# EasyEDA Pro project Advanced-filament-RunOut-Sensor.epro

# Schematic Filament runoff sensor
Board Name: Board1; Create Date: 2026-03-11; Page Name: P1; Project Name: Filament run out; Schematic Name: Filament runoff sensor; Update Date: 2026-03-12; Company: EasyEDA.com; Drawn: Paglu; Page Size: A4; Version: V1.0
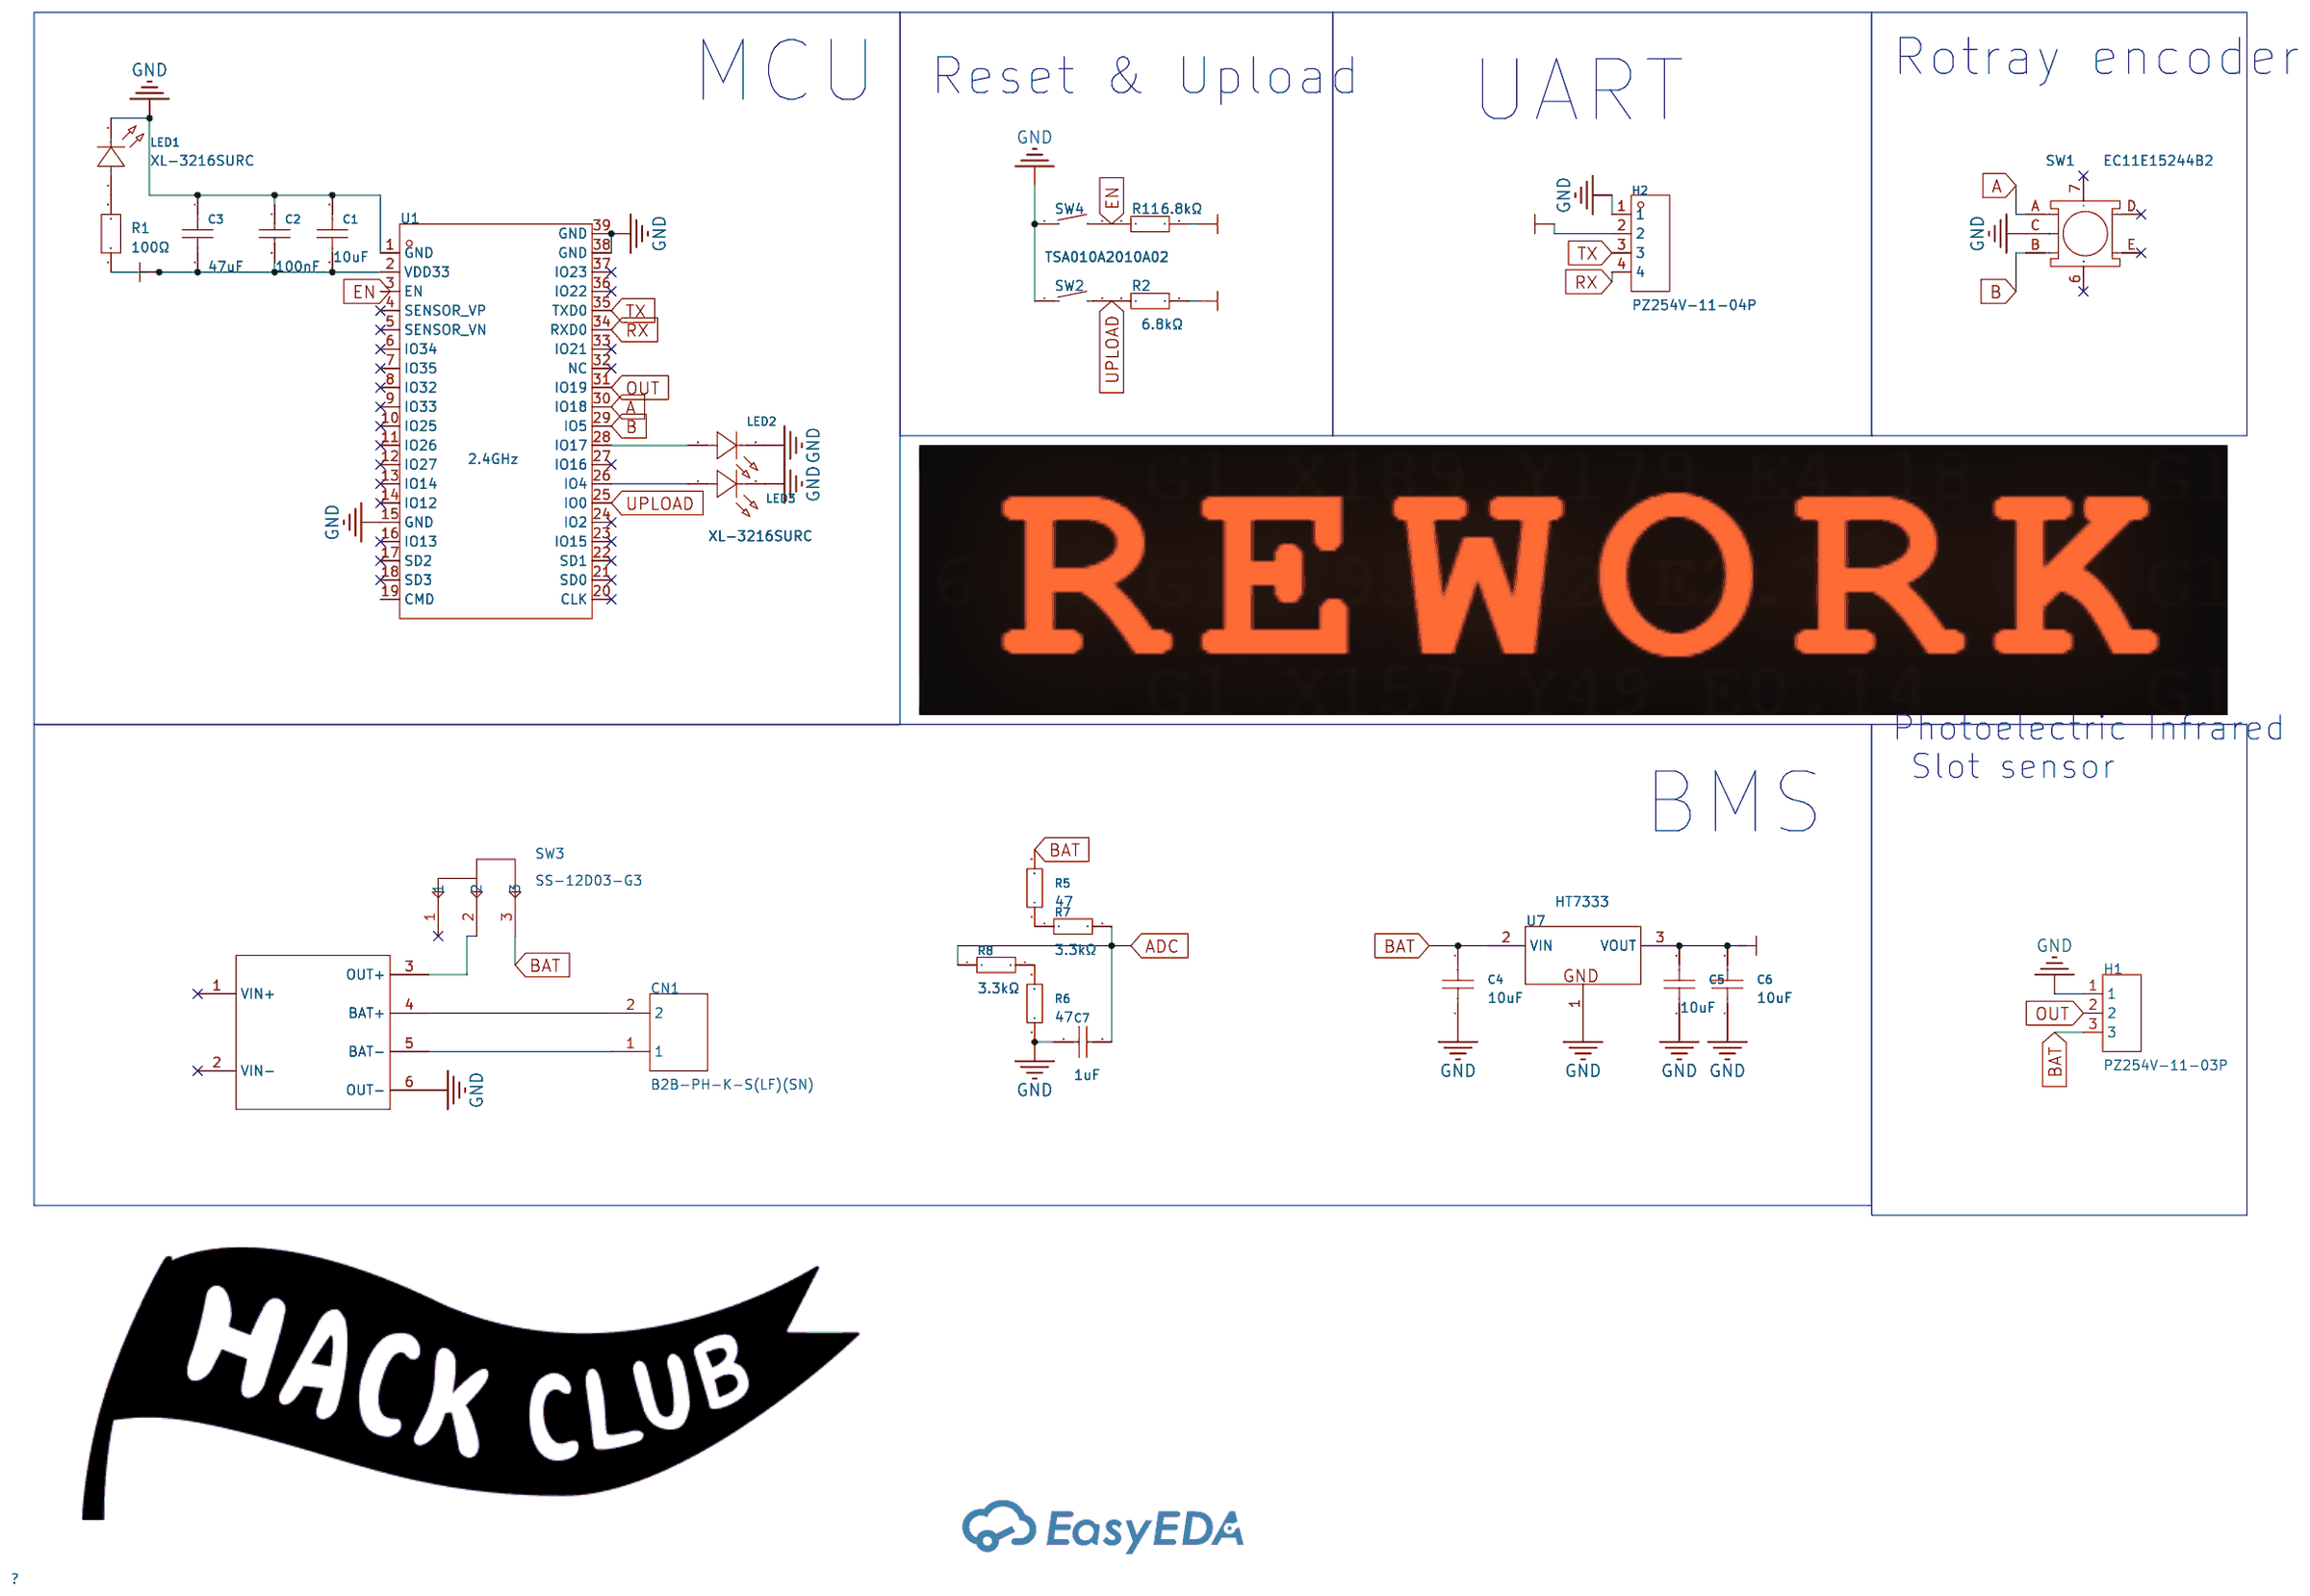
[diagram p0: schematic sheet]

## Parts
C1  10uF  [C1206]
C2  100nF  [C1206]
C3  47uF  [C1206]
C4  10uF  [C0603]
C5  10uF  [C0603]
C6  10uF  [C0603]
C7  1uF  [C0805]
CN1  B2B-PH-K-S(LF)(SN)  [CONN-TH_B2B-PH-K-S]
H1  PZ254V-11-03P  [HDR-TH_3P-P2.54-V-M_PZ254V-11-03P]
H2  PZ254V-11-04P  [HDR-TH_4P-P2.54-V-M]
LED1  XL-3216SURC  [LED1206-R-RD_RED]
LED2  XL-3216SURC  [LED1206-R-RD_RED]
LED3  XL-3216SURC  [LED1206-R-RD_RED]
R1  100Ω  [R1206]
R2  6.8kΩ  [R0603]
R5  47  [R1206]
R6  47  [R1206]
R7  3.3kΩ  [R0603]
R8  3.3kΩ  [R0603]
R11  6.8kΩ  [R0603]
SW1  EC11E15244B2  [SW-TH_EC11XXXXXXXX]
SW2  TSA010A2010A02  [KEY-SMD_L3.9-W3.0-LS5.0]
SW3  SS-12D03-G3  [SW-TH_3P-L8.5-W3.5-P2.50_SS-12D03-G3_C5160828]
SW4  TSA010A2010A02  [KEY-SMD_L3.9-W3.0-LS5.0]
U1  2.4GHz  [WIFIM-SMD_39P-L25.5-W18.0-P1.27-BL]
U6  -  [TP4056 Carging Module]
U7  HT7333  [SOT-89-3_L4.5-W2.5-P1.50-LS4.1-BR]

## Library data of the parts
C1 C3 = 1206B106K160CT: Capacitance:10uF Tolerance:±10% Tolerance:±10% Voltage Rating:16V Temperature Coefficient:X7R; LCSC Part Name: 10uF ±10% 16V; Supplier Part: C105197; Manufacturer: Walsin(华新科); Supplier Footprint: 1206; JLCPCB Part Class: Extended Part; Datasheet: https://item.szlcsc.com/datasheet/1206B106K160CT/106412.html; Supplier: LCSC; Tolerance: ±10%; Voltage Rating: 16V; Temperature Coefficient: X7R
C2 = CL31B104KBCNNNC: Capacitance:100nF Tolerance:±10% Tolerance:±10% Voltage Rating:50V Temperature Coefficient:X7R; LCSC Part Name: 100nF ±10% 50V; Supplier Part: C24497; Manufacturer: SAMSUNG(三星); Supplier Footprint: 1206; JLCPCB Part Class: Basic Part; Datasheet: https://item.szlcsc.com/datasheet/CL31B104KBCNNNC/25237.html; Supplier: LCSC; Tolerance: ±10%; Voltage Rating: 50V; Temperature Coefficient: X7R
C4-C6 = CL10A106MA8NRNC: Capacitance:10uF Tolerance:±20% Tolerance:±20% Voltage Rating:25V Temperature Coefficient:X5R; LCSC Part Name: 10uF ±20% 25V; Supplier Part: C96446; Manufacturer: SAMSUNG(三星); Supplier Footprint: 0603; JLCPCB Part Class: Basic Part; Datasheet: https://item.szlcsc.com/datasheet/CL10A106MA8NRNC/97651.html; Supplier: LCSC; Tolerance: ±20%; Voltage Rating: 25V; Temperature Coefficient: X5R
C7 = CL21B105KBFNNNE: Capacitance:1uF Tolerance:±10% Tolerance:±10% Voltage Rating:50V Temperature Coefficient:X7R; LCSC Part Name: 1uF ±10% 50V; Supplier Part: C28323; Manufacturer: SAMSUNG(三星); Supplier Footprint: 0805; JLCPCB Part Class: Basic Part; Datasheet: https://item.szlcsc.com/datasheet/CL21B105KBFNNNE/29074.html; Supplier: LCSC; Tolerance: ±10%; Voltage Rating: 50V; Temperature Coefficient: X7R
CN1 = B2B-PH-K-S(LF)(SN): Pins Structure:1x2P Pitch:2mm Mounting Type:Through Hole Reference Series:PH Number of Pins:2P Number of Rows:1 Number of PINs Per Row:2 Row Spacing:- Current Rating:2A Contact Material:Brass Contact Plating:Tin Operating Temperature:-25℃~+85℃ Operating T; LCSC Part Name: 1x2P 间距:2mm 直插 系列:PH; Supplier Part: C131337; Manufacturer: JST; Supplier Footprint: 插件,P=2mm; JLCPCB Part Class: Extended Part; Datasheet: https://item.szlcsc.com/datasheet/B2B-PH-K-S(LF)(SN)/142630.html; Supplier: LCSC; Pins Structure: 1x2P; Pitch: 2mm; Mounting Type: Through Hole; Reference Series: PH; Number of Pins: 2P; Number of Rows: 1; Number of PINs Per Row: 2; Current Rating: 2A; Contact Material: Brass; Contact Plating: Tin; Operating Temperature: -25℃~+85℃; Voltage Rating: 100V; Plastic Material: PA66; Flame Retardant Rating: UL94V-0; Supplementary Features: K Pin; Color: White; Z-Height of the Board: 6mm; X-Length of Bottom Edge on Board (Spacing Line): 5.9mm; Y-Width of Bottom Edge on Board: 4.5mm
H1 = PZ254V-11-03P: Pin Structure:1x3P Pitch:2.54mm Row Spacing:- Circluar Pins/Square Pins:Pin Header Mounting Type:Through Hole Number of Rows:1 Number of Pins:3P Current Rating:3A Voltage Rating (Max):250V Length of Mating Pin:6mm Insulation Height:2.5mm Length of End Con; LCSC Part Name: 1x3P 间距:2.54mm 方针 直插; Supplier Part: C2937625; Manufacturer: XFCN(兴飞); Supplier Footprint: 插件,P=2.54mm; JLCPCB Part Class: Extended Part; Datasheet: https://item.szlcsc.com/datasheet/PZ254V-11-03P/3293280.html; Supplier: LCSC; Pin Structure: 1x3P; Pitch: 2.54mm; Circluar Pins/Square Pins: Pin Header; Mounting Type: Through Hole; Number of Rows: 1; Number of Pins: 3P; Current Rating: 3A; Voltage Rating (Max): 250V; Length of Mating Pin: 6mm; Insulation Height: 2.5mm; Length of End Connection Pin: 3mm; Operating Temperature: -40℃~+105℃; Color: Black
H2 = PZ254V-11-04P: Pin Structure:1x4P Pitch:2.54mm Row Spacing:- Circluar Pins/Square Pins:Pin Header Mounting Type:Through Hole Number of Rows:1 Number of Pins:4P Current Rating:3A Voltage Rating (Max):250V Length of Mating Pin:6mm Insulation Height:2.5mm Length of End Con; LCSC Part Name: 1x4P 间距:2.54mm 方针 直插; Supplier Part: C2691448; Manufacturer: XFCN(兴飞); Supplier Footprint: 插件,P=2.54mm; JLCPCB Part Class: Extended Part; Datasheet: https://item.szlcsc.com/datasheet/PZ254V-11-04P/2801085.html; Supplier: LCSC; Pin Structure: 1x4P; Pitch: 2.54mm; Circluar Pins/Square Pins: Pin Header; Mounting Type: Through Hole; Number of Rows: 1; Number of Pins: 4P; Current Rating: 3A; Voltage Rating (Max): 250V; Length of Mating Pin: 6mm; Insulation Height: 2.5mm; Length of End Connection Pin: 3mm; Operating Temperature: -40℃~+105℃; Color: Black
LED1-LED3 = XL-3216SURC: Lamp Holder Type:- Illumination Color:Red Voltage - Forward(Vf):2.4V Voltage - Forward(Vf):2.4V Power(Watts):50mW Forward Current:20mA Wavelength - Dominant:615nm~630nm Wavelength - Dominant:615nm~630nm Peak Wavelength:620nm Diode Configuration:- Lens Col; LCSC Part Name: 1206红贴片式发光二极管; Supplier Part: C965822; Manufacturer: XINGLIGHT(成兴光); Supplier Footprint: 1206; JLCPCB Part Class: Extended Part; Datasheet: https://item.szlcsc.com/datasheet/XL-3216SURC/1051431.html; Supplier: LCSC; Illumination Color: Red; Voltage - Forward(Vf): 2.4V; Power(Watts): 50mW; Forward Current: 20mA; Wavelength - Dominant: 615nm~630nm; Peak Wavelength: 620nm; Lens Color: Water Clear; Luminous Intensity: 225mcd; Viewing Angle: 120°; Mounting Style: op View Mount; Operating Temperature: -40℃~+85℃
R1 = FRC1206F1000TS: Type:Thick Film Resistor Resistance:100Ω Tolerance:±1% Tolerance:±1% Power(Watts):250mW Voltage-Supply(Max):200V Temperature Coefficient:±100ppm/℃ Temperature Coefficient:±100ppm/℃ Operating Temperature:-55℃~+155℃ Operating Temperature:-55℃~+155℃; LCSC Part Name: 100Ω ±1% 250mW 厚膜电阻; Supplier Part: C2907369; Manufacturer: FOJAN(富捷); Supplier Footprint: 1206; JLCPCB Part Class: Extended Part; Supplier: LCSC; Type: Thick Film Resistor; Tolerance: ±1%; Power(Watts): 250mW; Voltage-Supply(Max): 200V; Temperature Coefficient: ±100ppm/℃; Operating Temperature: -55℃~+155℃
R2 R11 = RC0603FR-071KL: Type:Thick Film Resistor Resistance:1kΩ Tolerance:±1% Tolerance:±1% Power(Watts):100mW Voltage-Supply(Max):75V Temperature Coefficient:±100ppm/℃ Temperature Coefficient:±100ppm/℃ Operating Temperature:-55℃~+155℃ Operating Temperature:-55℃~+155℃; LCSC Part Name: 厚膜电阻 1kΩ ±1% 100mW; Supplier Part: C22548; Manufacturer: YAGEO(国巨); Supplier Footprint: 0603; JLCPCB Part Class: Extended Part; Datasheet: https://item.szlcsc.com/datasheet/RC0603FR-071KL/23274.html; Supplier: LCSC; Type: Thick Film Resistor; Tolerance: ±1%; Power(Watts): 100mW; Voltage-Supply(Max): 75V; Temperature Coefficient: ±100ppm/℃; Operating Temperature: -55℃~+155℃
R5 R6 = 1206W4F100KT5E: Type:Thick Film Resistor Resistance:1Ω Tolerance:±1% Tolerance:±1% Power(Watts):250mW Voltage-Supply(Max):200V Temperature Coefficient:±200ppm/℃ Temperature Coefficient:±200ppm/℃ Operating Temperature:-55℃~+155℃ Operating Temperature:-55℃~+155℃; LCSC Part Name: 1Ω ±1% 250mW 厚膜电阻; Supplier Part: C17928; Manufacturer: UNI-ROYAL(厚声); Supplier Footprint: 1206; JLCPCB Part Class: Basic Part; Datasheet: https://item.szlcsc.com/datasheet/1206W4F100KT5E/18616.html; Supplier: LCSC; Type: Thick Film Resistor; Tolerance: ±1%; Power(Watts): 250mW; Voltage-Supply(Max): 200V; Temperature Coefficient: ±200ppm/℃; Operating Temperature: -55℃~+155℃
R7 R8 = 0603WAF3301T5E: Type:Thick Film Resistor Resistance:3.3kΩ Tolerance:±1% Tolerance:±1% Power(Watts):100mW Voltage-Supply(Max):75V Temperature Coefficient:±100ppm/℃ Temperature Coefficient:±100ppm/℃ Operating Temperature:-55℃~+155℃ Operating Temperature:-55℃~+155℃; LCSC Part Name: 3.3kΩ ±1% 100mW 厚膜电阻; Supplier Part: C22978; Manufacturer: UNI-ROYAL(厚声); Supplier Footprint: 0603; JLCPCB Part Class: Basic Part; Datasheet: https://item.szlcsc.com/datasheet/0603WAF3301T5E/23705.html; Supplier: LCSC; Type: Thick Film Resistor; Tolerance: ±1%; Power(Watts): 100mW; Voltage-Supply(Max): 75V; Temperature Coefficient: ±100ppm/℃; Operating Temperature: -55℃~+155℃
SW1 = EC11E15244B2_C470754: Supplier Part: C470754; Manufacturer: ALPSALPINE(阿尔卑斯阿尔派); Supplier Footprint: 插件; JLCPCB Part Class: Extended Part; Datasheet: https://atta.szlcsc.com/upload/public/pdf/source/20191216/C470795_DE763ECE59BD49533DB26DB53E5D34B2.pdf; Supplier: LCSC
SW2 SW4 = TSA010A2010A02: Actuator Style:Round Button Operating Force:1N Mounting Type:Surface Mount,Vertical Length:3.9mm Width:3mm Switch Height:2mm Contact Current:50mA Voltage Rating:12V Life:-; LCSC Part Name: 3*4*2.0H-J 100gf 单弹平脚; Supplier Part: C2888943; Manufacturer: BZCN(博众电气); Supplier Footprint: SMD,3.9x3mm; JLCPCB Part Class: Extended Part; Datasheet: https://item.szlcsc.com/datasheet/TSA010A2010A02/3109346.html; Supplier: LCSC; Actuator Style: Round Button; Operating Force: 1N; Mounting Type: Surface Mount,Vertical; Length: 3.9mm; Width: 3mm; Switch Height: 2mm; Contact Current: 50mA; Voltage Rating: 12V
SW3 = SS-12D03-G3_C5160828: Supplier Part: C5160828; Manufacturer: DEALON(德艺隆); Supplier Footprint: 插件; JLCPCB Part Class: Extended Part; Datasheet: https://atta.szlcsc.com/upload/public/pdf/source/20220914/46967EFD64D75927271155BD7ED48D9B.pdf; Supplier: LCSC
U1 = ESP32-WROOM-32D-N4: Utilized IC / Part:ESP32-DOWD Wireless Standard:Bluetooth4.2 Interface Type:I2C；GPIO；SPI；UART Frequency:2.4GHz Antenna Type:On-board PCB Antenna Output Power:20.5dBm Output Power:20.5dBm Voltage - Supply:2.7V~3.6V Voltage - Supply:2.7V~3.6V Sensitivity:-9; LCSC Part Name: 不带固件 通用型Wi-Fi+BT+BLE MCU模组; Supplier Part: C473012; Manufacturer: ESPRESSIF(乐鑫); Supplier Footprint: SMD,25.5x18mm; JLCPCB Part Class: Extended Part; Datasheet: https://item.szlcsc.com/datasheet/ESP32-WROOM-32D-N4/479662.html; Supplier: LCSC; Utilized IC / Part: ESP32-DOWD; Wireless Standard: Bluetooth4.2; Interface Type: I2C；GPIO；SPI；UART; Antenna Type: On-board PCB Antenna; Output Power: 20.5dBm; Voltage - Supply: 2.7V~3.6V; Sensitivity: -98dBm; Operating Temperature: -40℃~+85℃
U6 = TP4056 Charging Module
U7 = HT7333: Output Type:-; Supplier Part: C259241; Supplier Footprint: SOT-89-3; JLCPCB Part Class: Extended Part; Supplier: LCSC

## Nets
+3V3: C1.2 C2.2 C3.2 C5.2 C6.2 H2.2 R1.1 R2.2 R11.2 U1.2(VDD33) U7.3(VOUT)
GND: C1.1 C2.1 C3.1 C4.1 C5.1 C6.1 C7.1 H1.1 H2.1 LED1.2(A) LED2.2(A) LED3.2(A) R6.1 SW1.C SW2.1 SW4.1 U1.1(GND) U1.15(GND) U1.38(GND) U1.39(GND) U6.6(OUT-) U7.1(GND)
A: SW1.A U1.30(IO18)
ADC: C7.2 R7.2 R8.1
B: SW1.B U1.29(IO5)
BAT: C4.2 H1.3 R5.2 SW3.3 U7.2(VIN)
EN: R11.1 SW4.2 U1.3(EN)
OUT: H1.2 U1.31(IO19)
RX: H2.4 U1.34(RXD0)
TX: H2.3 U1.35(TXD0)
UPLOAD: R2.1 SW2.2 U1.25(IO0)
$1N1540: LED1.1(K) R1.2
$1N1754: SW3.2 U6.3(OUT+)
$1N1756: CN1.2 U6.4(BAT+)
$1N1757: CN1.1 U6.5(BAT-)
$1N2179: R5.1 R7.1
$1N2180: R6.2 R8.2
$1N2787: LED2.1(K) U1.28(IO17)
$1N2791: LED3.1(K) U1.26(IO4)

Not connected (* = marked no-connect by the designer): SW1 6* 7* D* E*; SW3 1*; U1 4(SENSOR_VP)* 5(SENSOR_VN)* 6(IO34)* 7(IO35)* 8(IO32)* 9(IO33)* 10(IO25)* 11(IO26)* 12(IO27)* 13(IO14)* 14(IO12)* 16(IO13)* 17(SD2)* 18(SD3)* 19(CMD) 20(CLK)* 21(SD0)* 22(SD1)* 23(IO15)* 24(IO2)* 27(IO16)* 32(NC)* 33(IO21)* 36(IO22)* 37(IO23)*; U6 1(VIN+)* 2(VIN-)*

## Notes on the sheet
- Rotray encoder
- MCU
- Reset & Upload
- UART
- Photoelectric Infrared
   Slot sensor
- BMS

# Board PCB1
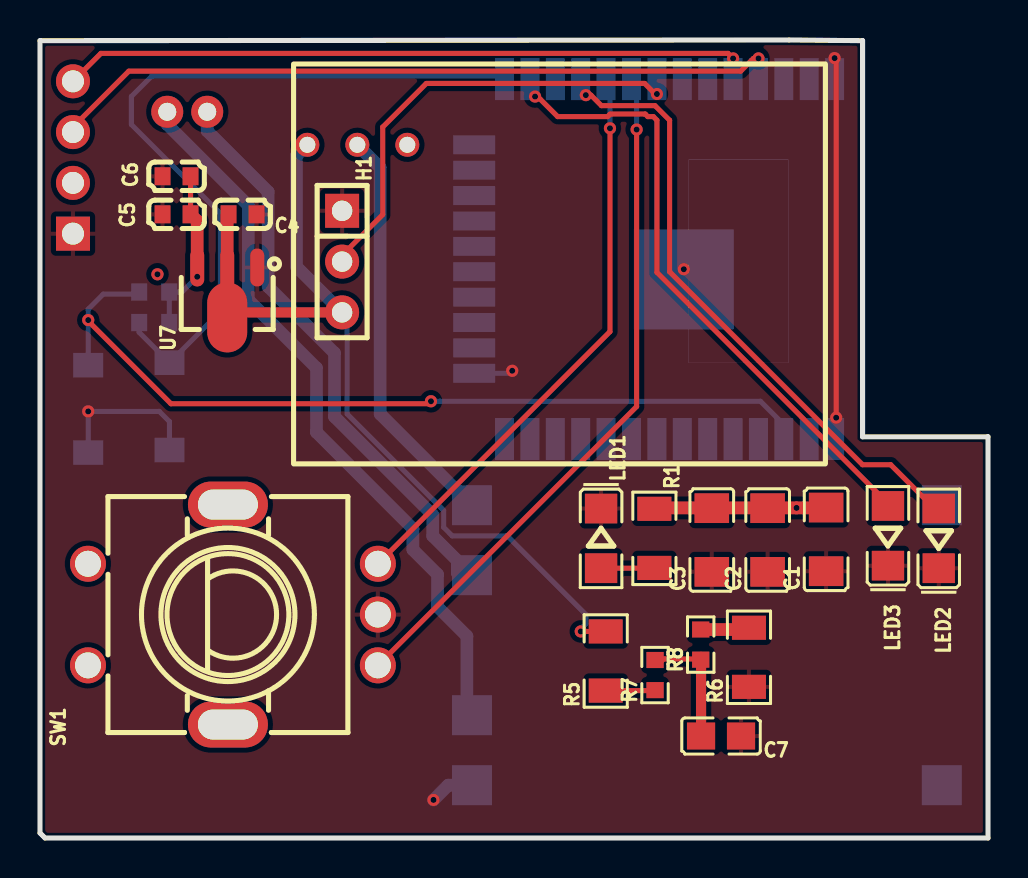
[diagram p1: board, top side]
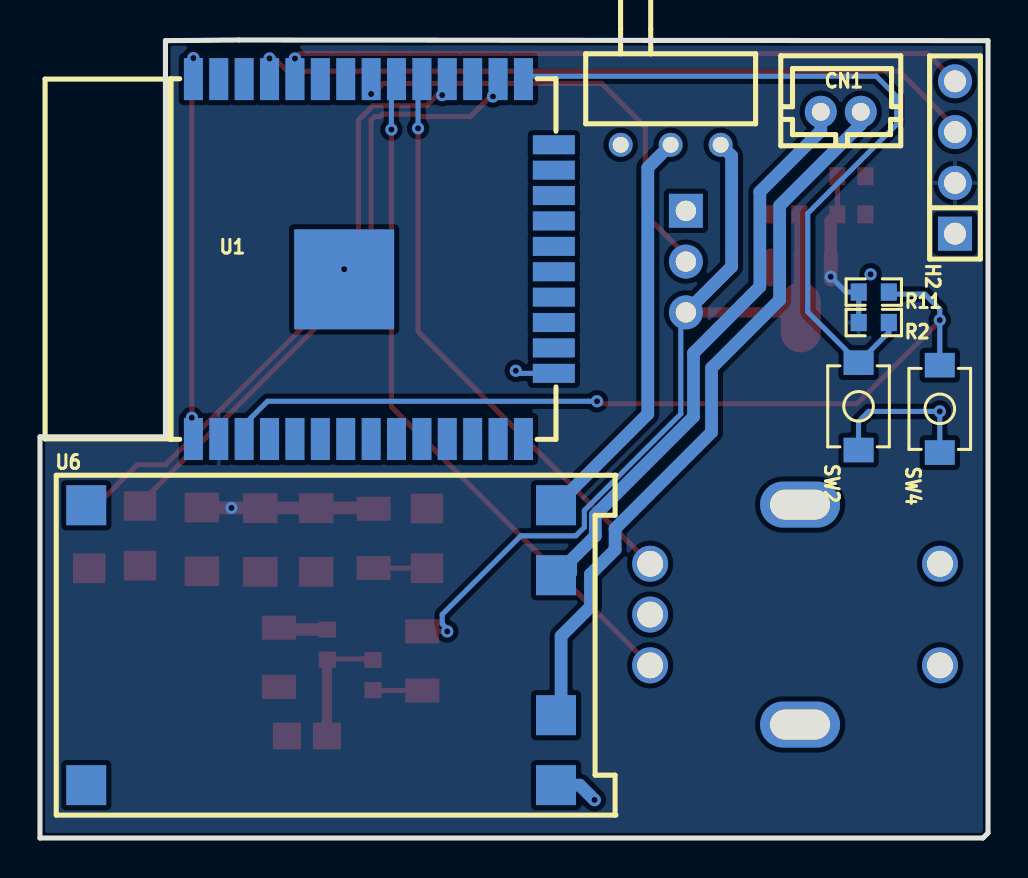
[diagram p2: board, bottom side, seen from below]

Outline 47.42 x 39.91 mm; copper layers: Top Layer, Bottom Layer. Coordinates in mm from the lower left corner of the outline.
Outline path: 0,39.88 37.47,39.91 41.15,39.88 41.15,20.07 47.42,20.07 47.42,0 0.25,0 0,0.25 0,39.88
Stack: Top Layer 0.035mm / Dielectric1 1.51mm FR4 er 4.5 / Bottom Layer 0.035mm

## Design rules (mm)
template: JLCPCB Capability(Two Layers Board)
spacing copperThickness1oz (default): track to track 0.102, other pairs 0.152 to 0.3
spacing copperThickness2oz: track to track 0.203, other pairs 0.152 to 0.3
track width copperThickness1oz (default): min 0.127, default 0.254, max 2.54
track width copperThickness2oz: min 0.203, default 0.254, max 2.54
differential pair differentialPair (default): width min 0.127, default 0.254, max 2.54; gap min 0.152, default 0.152
via viaSize (default): diameter min 0.5, default 0.61, max 10; hole min 0.3, default 0.305, max 6.3

## Placement (name value [footprint] x y rotation side)
C1  10uF  [C1206]  39.33 14.94 90 top
C2  100nF  [C1206]  36.4 14.9 90 top
C3  47uF  [C1206]  33.61 14.9 90 top
C4  10uF  [C0603]  10.13 31.19 180 top
C5  10uF  [C0603]  6.83 31.19 0 top
C6  10uF  [C0603]  6.83 33.1 0 top
C7  1uF  [C0805]  34.07 5.1 180 top
CN1  B2B-PH-K-S(LF)(SN)  [CONN-TH_B2B-PH-K-S]  7.37 36.32 180 bottom
H1  PZ254V-11-03P  [HDR-TH_3P-P2.54-V-M_PZ254V-11-03P]  15.11 28.83 270 top
H2  PZ254V-11-04P  [HDR-TH_4P-P2.54-V-M]  1.65 34.04 90 bottom
LED1  XL-3216SURC  [LED1206-R-RD_RED]  28.07 14.99 270 top
LED2  XL-3216SURC  [LED1206-R-RD_RED]  44.96 14.99 90 top
LED3  XL-3216SURC  [LED1206-R-RD_RED]  42.42 15.11 90 top
R1  100Ω  [R1206]  30.73 14.99 270 top
R2  6.8kΩ  [R0603]  5.71 25.78 0 bottom
R5  47  [R1206]  28.3 8.85 90 top
R6  47  [R1206]  35.46 9.04 90 top
R7  3.3kΩ  [R0603]  30.77 8.15 90 top
R8  3.3kΩ  [R0603]  33.05 9.67 90 top
R11  6.8kΩ  [R0603]  5.71 27.31 0 bottom
SW1  EC11E15244B2  [SW-TH_EC11XXXXXXXX]  9.65 11.18 90 top
SW2  TSA010A2010A02  [KEY-SMD_L3.9-W3.0-LS5.0]  6.48 21.59 90 bottom
SW3  SS-12D03-G3  [SW-TH_3P-L8.5-W3.5-P2.50_SS-12D03-G3_C5160828]  15.88 34.67 180 bottom
SW4  TSA010A2010A02  [KEY-SMD_L3.9-W3.0-LS5.0]  2.41 21.46 90 bottom
U1  2.4GHz  [WIFIM-SMD_39P-L25.5-W18.0-P1.27-BL]  30.73 28.96 180 bottom
U6  -  [TP4056 Carging Module]  46.61 1.14 180 bottom
U7  HT7333  [SOT-89-3_L4.5-W2.5-P1.50-LS4.1-BR]  9.37 27.29 90 top

## Footprints (pads in the part's own frame, mm; a bottom-side part is the same pattern mirrored in y, then rotated)
C0603
  rect 0.8x0.9 smd: 1(-0.7,0) 2(0.7,0)
C0805
  rect 1.41x1.35 smd: 1(-1,0) 2(1,0)
C1206
  rect 1.485x1.728 smd: 1(-1.593,0) 2(1.593,0)
CONN-TH_B2B-PH-K-S
  round 1.6 hole 0.9: 1(1,0) 2(-1,0)
HDR-TH_3P-P2.54-V-M_PZ254V-11-03P
  rect 1.7x1.7 hole 1.02: 1(-2.54,0)
  round 1.7 hole 1.02: 2(0,0) 3(2.54,0)
HDR-TH_4P-P2.54-V-M
  rect 1.7x1.7 hole 1.1: 1(-3.81,0)
  round 1.7 hole 1.1: 2(-1.27,0) 3(1.27,0) 4(3.81,0)
KEY-SMD_L3.9-W3.0-LS5.0
  rect 1.23x1.5 smd: 1(-2.185,0) 2(2.185,0)
LED1206-R-RD_RED
  rect 1.485x1.62 smd: 1(1.492,0) 2(-1.492,0)
R0603
  rect 0.806x0.864 smd: 1(-0.753,0) 2(0.753,0)
R1206
  rect 1.208x1.701 smd: 1(-1.479,0) 2(1.479,0)
SOT-89-3_L4.5-W2.5-P1.50-LS4.1-BR
  oval 1.9x0.7 smd: 1(1.25,-1.501) 3(1.25,1.501)
  oval 3.5x2 smd: 2(-1.25,0)
  oval 2.1x0.7 smd: 2(1.151,0)
SW-TH_3P-L8.5-W3.5-P2.50_SS-12D03-G3_C5160828
  round 1.2 hole 0.8: 1(-2.5,0) 2(0,0) 3(2.5,0)
SW-TH_EC11XXXXXXXX
  oval 2.3x4 hole 1.5x3: 6(5.5,0.25) 7(-5.5,0.25)
  round 1.8 hole 1.3: A(-2.54,-7.25) B(2.54,-7.25) C(0,-7.25) D(-2.54,7.25) E(2.54,7.25)
TP4056 Carging Module
  rect 2x2 smd: 1(1.5,15.5) 2(1.5,1.5) 3(25,15.5) 4(25,12) 5(25,5) 6(25,1.5)
WIFIM-SMD_39P-L25.5-W18.0-P1.27-BL
  rect 0.95x2.1 smd: 1(-9.015,-9) 2(-7.745,-9) 3(-6.475,-9) 4(-5.205,-9) 5(-3.935,-9) 6(-2.665,-9) 7(-1.395,-9) 8(-0.125,-9) 9(1.145,-9) 10(2.415,-9) 11(3.685,-9) 12(4.955,-9) 13(6.225,-9) 14(7.495,-9) 25(7.495,9) 26(6.225,9) 27(4.955,9) 28(3.685,9) 29(2.415,9) 30(1.145,9) 31(-0.125,9) 32(-1.395,9) 33(-2.665,9) 34(-3.935,9) 35(-5.205,9) 36(-6.475,9) 37(-7.745,9) 38(-9.015,9)
  rect 2.1x0.95 smd: 15(9.015,-5.715) 16(9.015,-4.445) 17(9.015,-3.175) 18(9.015,-1.905) 19(9.015,-0.635) 20(9.015,0.635) 21(9.015,1.905) 22(9.015,3.175) 23(9.015,4.445) 24(9.015,5.715)
  rect 5x5 smd: 39(-1.472,-1.017)

## Nets
As in the schematic.

Pads without a net: SW1 6 7 D E; SW3 1; U1 4 5 6 7 8 9 10 11 12 13 14 16 17 18 19 20 21 22 23 24 27 32 33 36 37; U6 1 2

## Via types
v1: diameter 0.61, hole 0.305, Top Layer to Bottom Layer, 19 vias

## Routing (per net, layer and track width the routed paths; a pad name or vN(x,y) marks a point on that pad's centre or on a via; arc(x,y) is an arc through that point)
+3V3: length 17
  Top Layer w0.254: C5.2 C6.2
  Top Layer w0.635: 39.31,16.51 v1(37.85,16.51) 30.78,16.51 R1.1 ; C5.2 7.87,30.86 v1(7.87,28.07)
  Bottom Layer w0.254: v1(7.87,28.07) 7.1,27.31 R11.2 R2.2
GND: length 31
  Top Layer w0.254: v1(39.83,21.02) 39.83,38.93 v1(39.75,39.01)
  Bottom Layer w0.254: SW4.1 v1(2.41,21.34) 5.97,21.34 6.48,20.83 SW2.1 ; U1.15 23.49,23.24 v1(23.62,23.37) ; U1.38 v1(39.75,39.01)
  Bottom Layer w0.635: U6.6 20.42,2.64 v1(19.68,1.91)
  vias: v1(32.21,28.45)
A: length 34.5
  Top Layer w0.254: SW1.A 29.85,21.58 v1(29.85,35.43)
  Bottom Layer w0.254: 29.89,37.75 29.85,37.7 v1(29.85,35.43)
ADC: length 6.4
  Top Layer w0.254: 33.07,9.06 33.05,9.08 32.92,8.96 31.2,8.96 31.02,8.78 30.77,8.78
  Top Layer w0.508: C7.2 33.07,9.06
B: length 28.9
  Top Layer w0.254: v1(28.51,35.5) 28.51,25.33 SW1.B
  Bottom Layer w0.254: v1(28.51,35.5) 28.51,37.64 28.62,37.75
BAT: length 42
  Top Layer w0.254: R5.2 v1(27.05,10.33)
  Top Layer w0.508: U7.2 9.62,26.29 H1.3
  Top Layer w0.635: C4.2 9.37,31.12 U7.2
  Bottom Layer w0.254: 15.24,26.16 15.24,26.04 15.37,25.91 15.37,21.21 20.19,16.38 20.19,15.54 20.62,15.11 23.37,15.11 27.3,11.18 27.3,10.71 27.05,10.46 v1(27.05,10.33)
  Bottom Layer w0.635: SW3.3 12.83,34.12 12.83,28.58 H1.3
EN: length 43.7
  Top Layer w0.254: v1(2.41,25.9) 2.41,25.86 6.55,21.72 19.43,21.72 v1(19.56,21.84)
  Bottom Layer w0.254: SW4.2 v1(2.41,25.9) 2.41,26.45 3.16,27.2 4.86,27.2 R11.1 ; U1.3 37.39,20.14 37.39,20.49 36.04,21.84 20.01,21.84 v1(19.56,21.84)
OUT: length 22.4
  Top Layer w0.254: H1.2 15.13,28.85 15.13,29.17 17.14,31.18 17.14,35.56 19.32,37.74 30.25,37.74 30.77,37.21 v1(30.86,37.21)
RX: length 33.7
  Top Layer w0.254: H2.4 3.05,39.24 34.42,39.24 v1(34.67,38.99)
TX: length 36
  Top Layer w0.254: v1(35.94,38.99) 35.69,38.99 35.05,38.35 4.45,38.35 1.65,35.56 H2.3
UPLOAD: length 38
  Bottom Layer w0.254: R2.1 4.96,25.29 SW2.2 9.02,26.31 9.02,31.24 4.57,35.69 4.57,37.08 5.59,38.1 23.1,38.1 U1.25
$1N1540: length 2.7
  Top Layer w0.254: LED1.1 30.75,13.49 30.76,13.48
$1N1754: length 20.4
  Bottom Layer w0.635: SW3.2 17.02,33.53 17.02,21.21 21.58,16.64 U6.3
$1N1756: length 29
  Bottom Layer w0.635: U6.4 21,13.14 20.88,13.27 20.88,13.88 19.65,15.11 19.65,16.16 14.73,21.07 14.73,24.26 11.41,27.58 11.41,32.32 8.37,35.36 CN1.2
$1N1757: length 36.5
  Bottom Layer w0.635: U6.5 21.36,6.4 21.36,10.1 19.89,11.57 19.89,13.19 18.66,14.42 18.66,15.47 13.83,20.3 13.83,23.51 10.42,26.92 10.42,31.63 6.37,35.69 CN1.1
$1N2179: length 2.5
  Top Layer w0.254: R5.1 30.66,7.37 30.77,7.27
$1N2180: length 2.5
  Top Layer w0.635: 35.46,10.52 35.37,10.43 33.05,10.43
$1N2481:
  vias: v1(5.88,28.19)
$1N2787: length 31.6
  Top Layer w0.254: LED2.1 44.83,16.61 44.62,16.61 42.56,18.67 41.15,18.67 31.5,28.32 31.5,35.9 30.77,36.63 28.09,36.63 27.56,37.16 v1(27.3,37.16)
  Bottom Layer w0.254: U1.28 27.05,37.41 v1(27.3,37.16)
$1N2791: length 31.7
  Top Layer w0.254: LED3.1 42.42,16.73 30.86,28.29 30.86,35.9 30.68,36.08 30.4,36.08 30.28,36.21 28.52,36.21 28.4,36.08 25.9,36.08 25.02,36.96 v1(24.77,37.08)
  Bottom Layer w0.254: v1(24.77,37.08) 24.51,37.34 U1.26

## Copper pours and planes (outline as drawn; the poured copper is in the pictures)
+3V3 on Bottom Layer: 40.89,39.75 40.89,19.94 47.17,19.94 47.17,-0.13 0,-0.13 -0.25,0.13 -0.25,39.75 37.22,39.79
GND on Top Layer: 40.89,39.75 40.89,19.94 47.17,19.94 47.17,-0.13 0,-0.13 -0.25,0.13 -0.25,39.75 37.22,39.79
